# Altium schematic sheet Sheet1.SchDoc
size A4
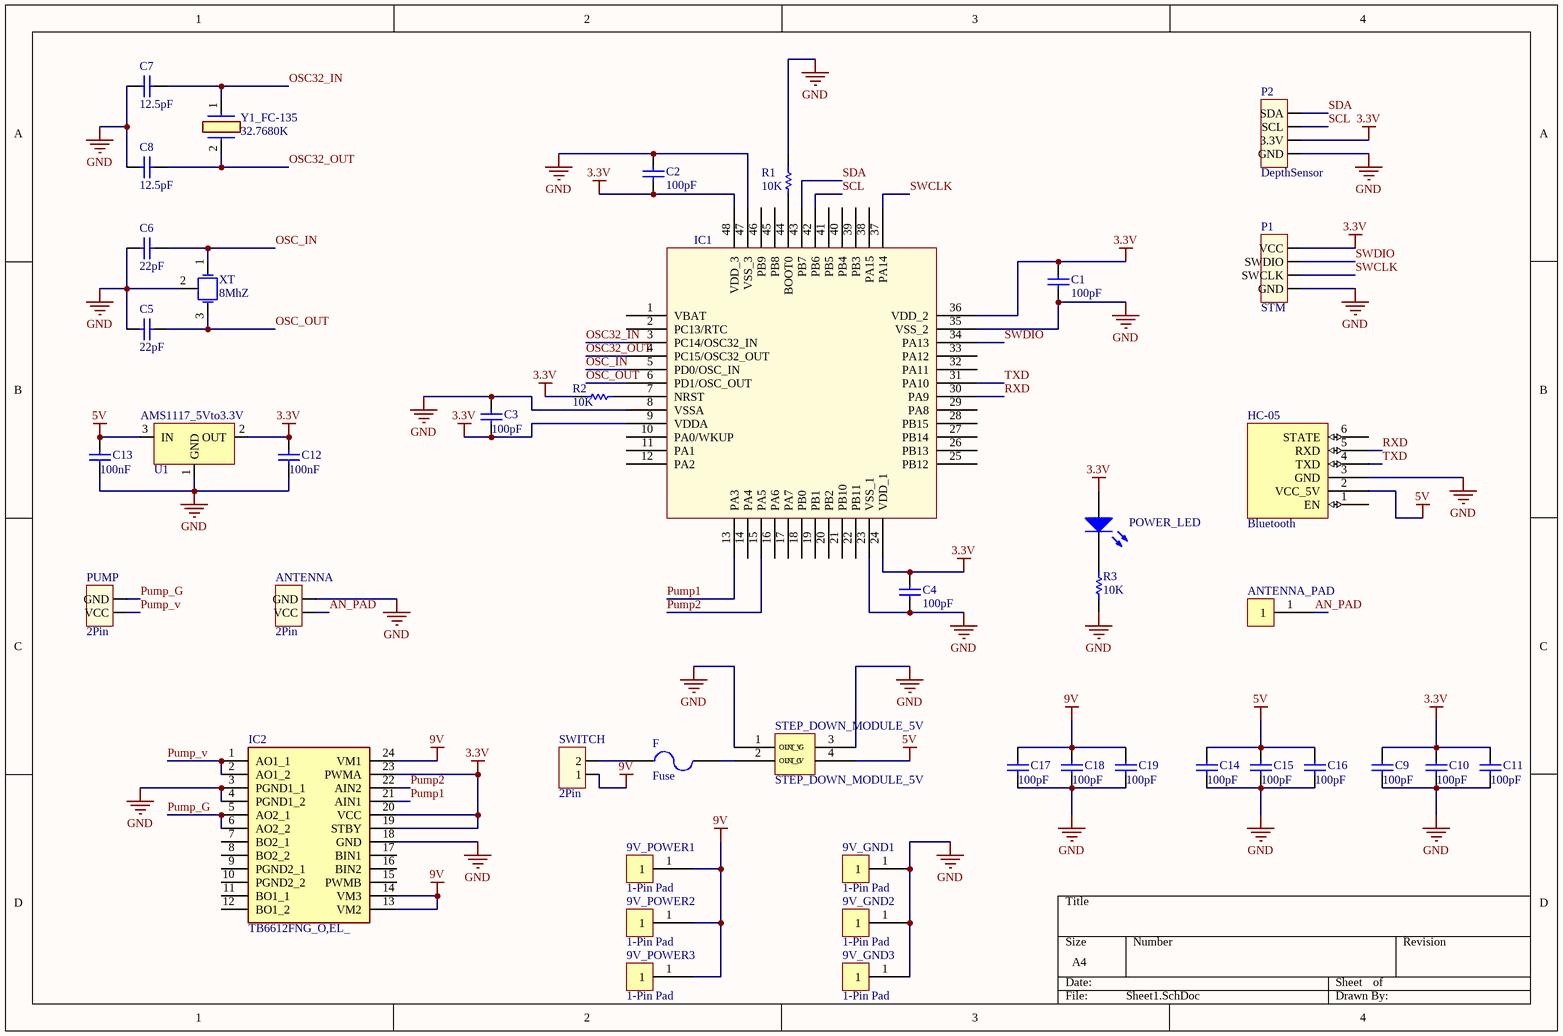
[diagram p0: Sheet1.SchDoc]

## Parts
9V_GND1  1-Pin Pad  [1-Pin Pad]
9V_GND2  1-Pin Pad  [1-Pin Pad]
9V_GND3  1-Pin Pad  [1-Pin Pad]
9V_POWER1  1-Pin Pad  [1-Pin Pad]
9V_POWER2  1-Pin Pad  [1-Pin Pad]
9V_POWER3  1-Pin Pad  [1-Pin Pad]
ANTENNA  2Pin  [XH2.54-2pin]
ANTENNA_PAD  1-Pin Pad  [1-Pin Pad]  (value not drawn)
C1  100pF  [C0805]
C2  100pF  [C0805]
C3  100pF  [C0805]
C4  100pF  [C0805]
C5  22pF  [C0805]
C6  22pF  [C0805]
C7  12.5pF  [C0805]
C8  12.5pF  [C0805]
C9  100pF  [C0805]
C10  100pF  [C0805]
C11  100pF  [C0805]
C12  100nF  [C0805]
C13  100nF  [C0805]
C14  100pF  [C0805]
C15  100pF  [C0805]
C16  100pF  [C0805]
C17  100pF  [C0805]
C18  100pF  [C0805]
C19  100pF  [C0805]
F  Fuse  [FUSE-PPTC-30V - 5A]
HC-05  Bluetooth  [hc-05]
IC1  STM32F103C8T6  [LQFP48]  (value not drawn)
IC2  TB6612FNG_O,EL_  [SOP65P760X160-24N]
P1  STM  [XH2.54-4pin]
P2  DepthSensor  [XH2.54-4pin]
POWER_LED  LED  [LED-0805]  (value not drawn)
PUMP  2Pin  [XH2.54-2pin]
R1  10K  [R0805]
R2  10K  [R0805]
R3  10K  [R0805]
STEP_DOWN_MODULE_5V  STEP_DOWN_MODULE_5V  [STEP_DOWN_MODULE_5V]
SWITCH  2Pin  [XH2.54-2pin]
U1  AMS1117_5Vto3.3V  [AMS1117 - SOT-223]
XT  8MhZ  [3225-P]
Y1_FC-135  32.7680K  [FC135327680KAAG0]

## Nets
3.3V: C1.2 C2.1 C3.1 C4.2 C9.2 C10.2 C11.2 C12.2 IC1.9(VDDA) IC1.24(VDD_1) IC1.36(VDD_2) IC1.48(VDD_3) IC2.19(STBY) IC2.20(VCC) IC2.23(PWMA) P1.4(VCC) P2.2(3.3V) POWER_LED.1(A) R2.1 U1.2(OUT)
5V: C13.2 C14.2 C15.2 C16.2 HC-05.2(VCC_5V) STEP_DOWN_MODULE_5V.4(OUT_V) U1.3(IN)
9V: 9V_POWER1.1 9V_POWER2.1 9V_POWER3.1 C17.2 C18.2 C19.2 IC2.13(VM2) IC2.14(VM3) IC2.24(VM1) SWITCH.1
GND: 9V_GND1.1 9V_GND2.1 9V_GND3.1 ANTENNA.2(GND) C1.1 C2.2 C3.2 C4.1 C5.1 C6.1 C7.1 C8.1 C9.1 C10.1 C11.1 C12.1 C13.1 C14.1 C15.1 C16.1 C17.1 C18.1 C19.1 HC-05.3(GND) IC1.8(VSSA) IC1.23(VSS_1) IC1.35(VSS_2) IC1.47(VSS_3) IC2.3(PGND1_1) IC2.4(PGND1_2) IC2.18(GND) P1.1(GND) P2.1(GND) R1.2 R3.1 STEP_DOWN_MODULE_5V.1(IN_V) STEP_DOWN_MODULE_5V.3(OUT_G) U1.1(GND) XT.2
AN_PAD: ANTENNA.1(VCC) ANTENNA_PAD.1
OSC32_IN: C7.2 IC1.3(PC14/OSC32_IN) Y1_FC-135.1(CRYSTAL_1)
OSC32_OUT: C8.2 IC1.4(PC15/OSC32_OUT) Y1_FC-135.2(CRYSTAL_2)
OSC_IN: C6.2 IC1.5(PD0/OSC_IN) XT.1(OSC1)
OSC_OUT: C5.2 IC1.6(PD1/OSC_OUT) XT.3(OSC2)
Pump1: IC1.13(PA3) IC2.21(AIN1)
Pump2: IC1.15(PA5) IC2.22(AIN2)
Pump_G: IC2.5(AO2_1) IC2.6(AO2_2) PUMP.2(GND)
Pump_v: IC2.1(AO1_1) IC2.2(AO1_2) PUMP.1(VCC)
RXD: HC-05.5(RXD) IC1.30(PA9)
SCL: IC1.42(PB6) P2.3(SCL)
SDA: IC1.43(PB7) P2.4(SDA)
SWCLK: IC1.37(PA14) P1.2(SWCLK)
SWDIO: IC1.34(PA13) P1.3(SWDIO)
TXD: HC-05.4(TXD) IC1.31(PA10)
NetF_1: F.1 SWITCH.2
NetF_2: F.2 STEP_DOWN_MODULE_5V.2(IN_G)
NetIC1_7: IC1.7(NRST) R2.2
NetIC1_44: IC1.44(BOOT0) R1.1
NetPOWER_LED_2: POWER_LED.2(K) R3.2

Not connected (* = marked no-connect by the designer): HC-05 1(EN) 6(STATE); IC1 1(VBAT) 2(PC13/RTC) 10(PA0/WKUP) 11(PA1) 12(PA2) 14(PA4) 16(PA6) 17(PA7) 18(PB0) 19(PB1) 20(PB2) 21(PB10) 22(PB11) 25(PB12) 26(PB13) 27(PB14) 28(PB15) 29(PA8) 32(PA11) 33(PA12) 38(PA15) 39(PB3) 40(PB4) 41(PB5) 45(PB8) 46(PB9); IC2 7(BO2_1) 8(BO2_2) 9(PGND2_1) 10(PGND2_2) 11(BO1_1) 12(BO1_2) 15(PWMB) 16(BIN2) 17(BIN1)

## Library data of the parts
C1-C19 = Cap: value: *
F = Fuse: PPTC; ComponentLink1Description: Datasheet; ComponentLink1URL: https://www.flying1688.com/products_detail_1566.htm
HC-05 = HC-05
IC2 = TB6612FNG_O,EL_: Integrated Circuit; Manufacturer_Name: Toshiba; Manufacturer_Part_Number: TB6612FNG(O,EL); Datasheet Link: https://th.mouser.com/datasheet/2/408/TB6612FNG_datasheet_en_20141001-708260.pdf; Height: 1.6mm; Mouser Part Number: 757-TB6612FNG(O,EL); Mouser Price/Stock: https://www.mouser.co.uk/ProductDetail/Toshiba/TB6612FNGOEL?qs=%2FbfygUuxYr5ys7QLPOzyng%3D%3D
P1 P2 = 4Pin
R1-R3 = Resistor_1: value: *
U1 = AMS1117: pin to pad: 2>2+4
XT = Passive Crystal: frequency: *
Y1_FC-135 = FC-135_32.7680KA-AG0: Crystal or Oscillator; Manufacturer_Name: Epson Timing; Manufacturer_Part_Number: FC-135 32.7680KA-AG0; Datasheet Link: https://support.epson.biz/td/api/doc_check.php?dl=brief_FC-135&lang=en/.pdf; Height: 0.9mm; Mouser Part Number: 732-FC135-32.76KAAG0; Mouser Price/Stock: https://www.mouser.co.uk/ProductDetail/Epson-Timing/FC-135-32.7680KA-AG0?qs=l3LL3yk8ONZCQSM4diwOUg%3D%3D; Arrow Part Number: FC-135 32.7680KA-AG0; Arrow Price/Stock: https://www.arrow.com/en/products/fc-13532.7680ka-ag0/epson-electronics-america?region=nac